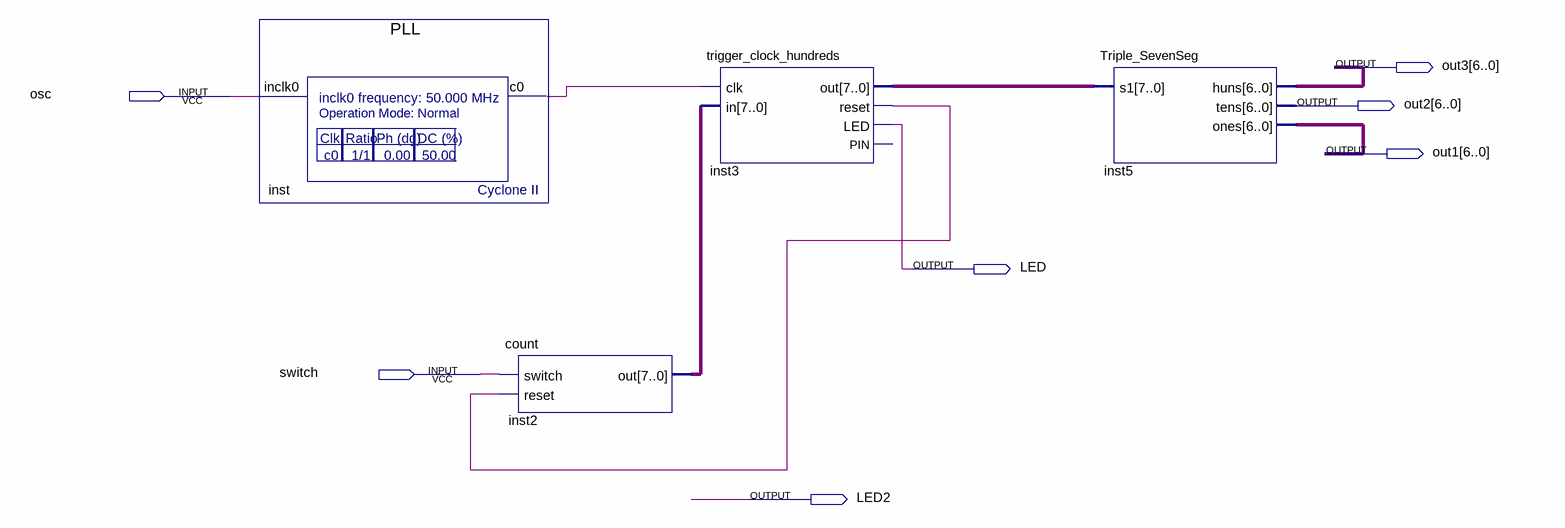
[diagram p0: schematic sheet]
// Quartus schematic TimeBinHundreds.bdf as structural Verilog: 4 symbols, 7 pins
module TimeBinHundreds (
  input  osc,
  input  switch,
  output [6:0] out3,
  output [6:0] out2,
  output [6:0] out1,
  output LED,
  output LED2
);

  wire inst3_reset, inst_c0;
  wire [7:0] inst2_out, inst3_out;

  PLL inst (.inclk0(osc), .c0(inst_c0));
  count inst2 (.switch(switch), .reset(inst3_reset), .out(inst2_out));
  trigger_clock_hundreds inst3 (
    .clk(inst_c0), .in(inst2_out), .out(inst3_out), .reset(inst3_reset), .LED(LED));  // open: PIN
  Triple_SevenSeg inst5 (.s1(inst3_out), .huns(out3), .tens(out2), .ones(out1));
endmodule
